# EAGLE design EW Driver (EAGLE 7.5.0)

## Sheet 1 of 2
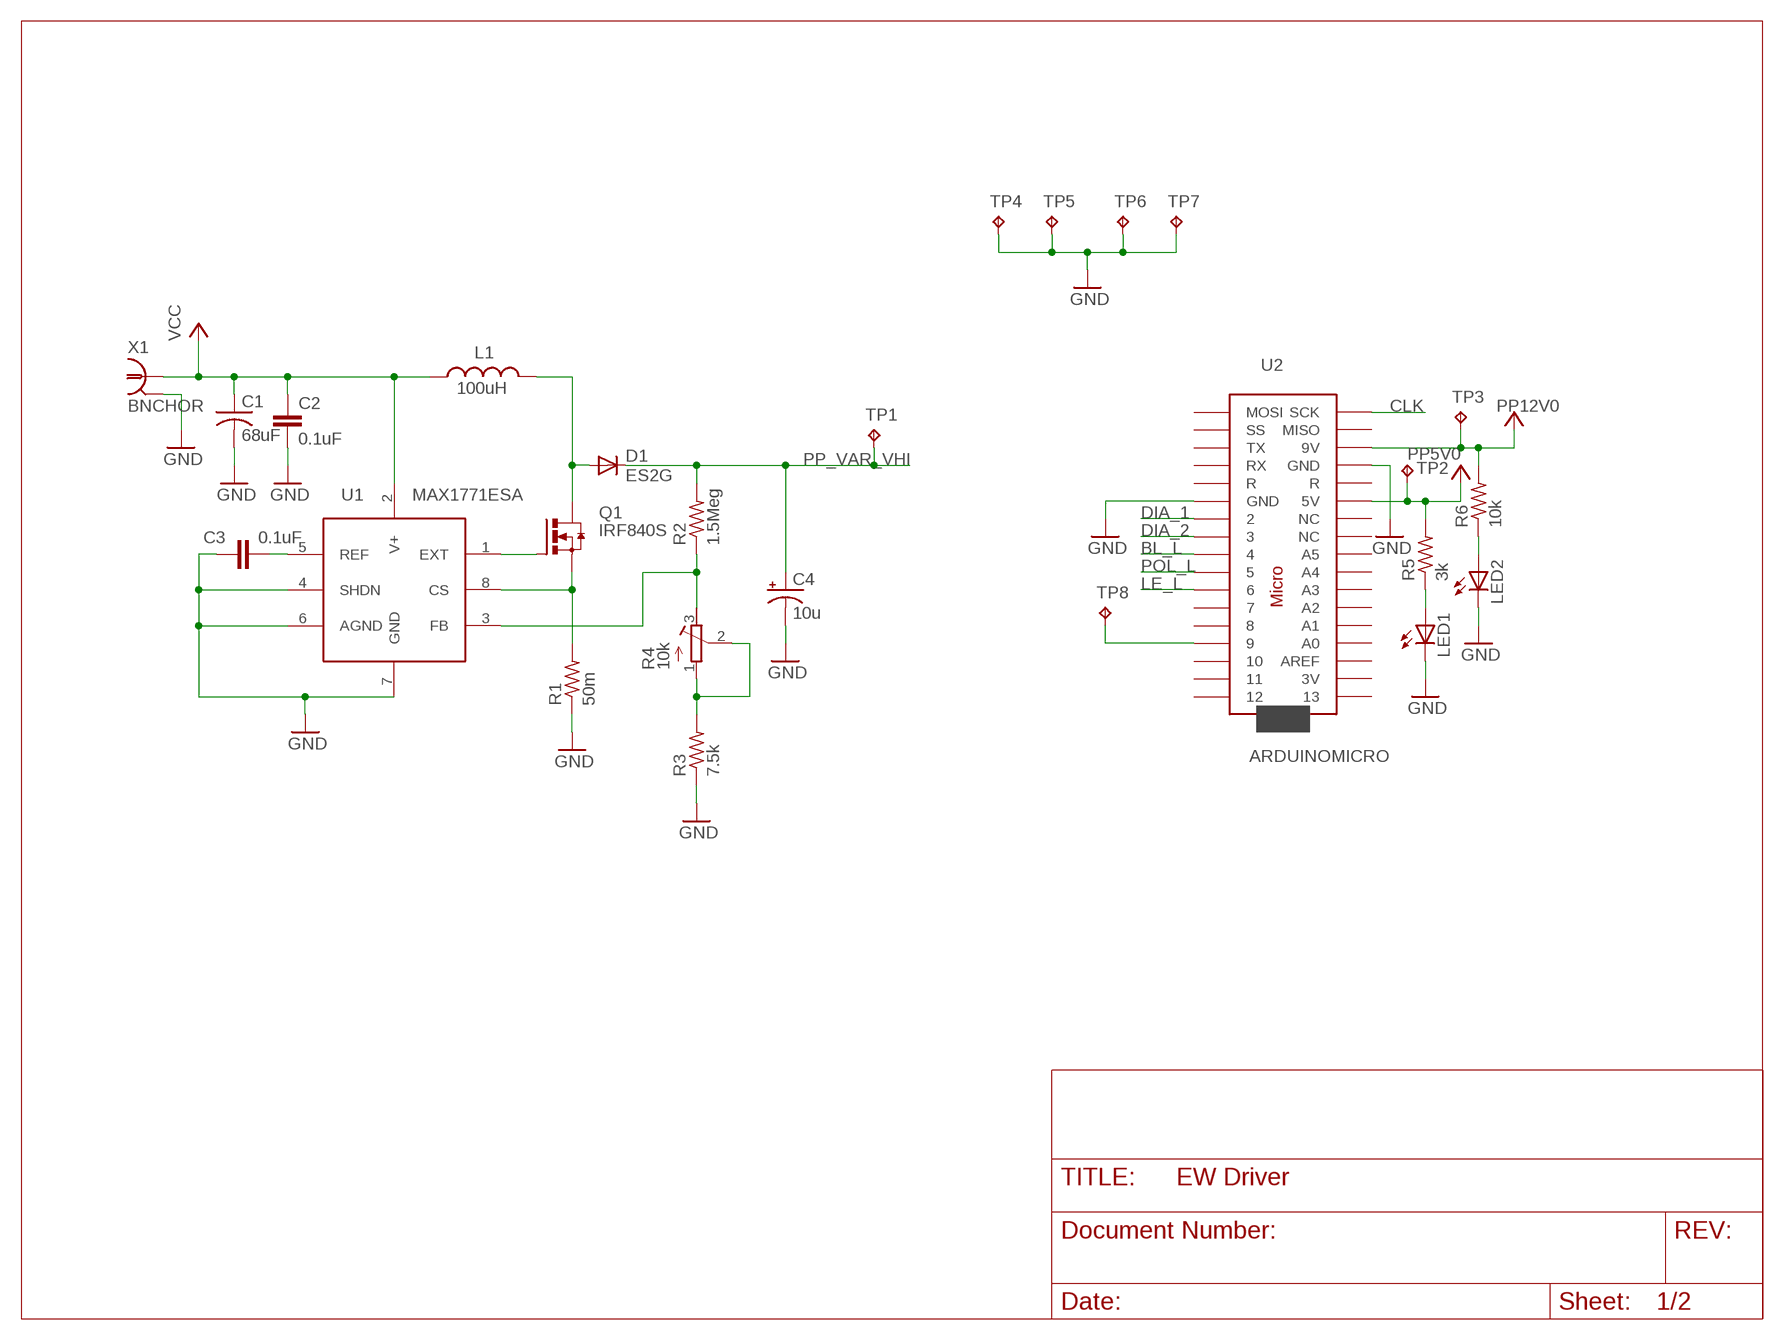
[diagram p0: schematic, sheet 1]

### Parts
C1  68uF  CC2312  [C2312]
C2  0.1uF  CC1206  [C1206]
C3  0.1uF  CC1206  [C1206]
C4  10u  10UF-350V-20%(ELECT)  [PANASONIC_D]
D1  ES2G  DIODE-DO214AA  [DO214AA]
L1  100uH  TDK_IND  [P0762NL]
LED1  LED_ESML0603  [LED_SML0603]
LED2  LED_ESML0603  [LED_SML0603]
Q1  IRF840S  [D2PACK]
R1  50m  R-US_R1206  [R1206]
R2  1.5Meg  R-US_R1206  [R1206]
R3  7.5k  R-US_R0805  [R0805]
R4  10k  R-TRIMM3296P  [RTRIM3296P]
R5  3k  R-US_R0805  [R0805]
R6  10k  R-US_R0805  [R0805]
TP1  TP  [TEST_SMT]
TP2  TP  [TEST_SMT]
TP3  TP  [TEST_SMT]
TP4  TP063  [TEST_TH]
TP5  TP063  [TEST_TH]
TP6  TP063  [TEST_TH]
TP7  TP063  [TEST_TH]
TP8  TP  [TEST_SMT]
U1  MAX1771ESA  [SO08]
U2  ARDUINOMICRO  [ARDUINOMICRO]
X1  BNCHOR  [BNC_HOR]

### Nets
BL_L: U2.P$9 ; also sheet 2
CLK: U2.P$18(SCK) ; also sheet 2
DIA_1: U2.P$11 ; also sheet 2
DIA_2: U2.P$10 ; also sheet 2
GND: C1.2 C2.2 C3.2 C4.- LED1.C LED2.C R1.1 R3.1 TP4.TP TP5.TP TP6.TP TP7.TP U1.4(SHDN) U1.6(AGND) U1.7(GND) U2.P$12(GND) U2.P$21(GND) X1.2 X1.3 ; also sheet 2
LE_L: U2.P$7 ; also sheet 2
N$1: C3.1 U1.5(REF)
N$2: Q1.1(G) U1.1(EXT)
N$3: Q1.3(S) R1.2 U1.8(CS)
N$4: D1.A L1.2 Q1.2(D)
N$5: R3.2 R4.1(A) R4.2(S)
N$6: R2.1 R4.3(E) U1.3(FB)
N$10: LED1.A R5.1
N$11: LED2.A R6.1
N$12: TP8.TP U2.P$4
POL_L: U2.P$8 ; also sheet 2
PP5V0: R5.2 TP2.TP U2.P$23(5V) ; also sheet 2
PP12V0: C1.1 C2.1 L1.1 R6.2 TP3.TP U1.2(V+) U2.P$20(9V) X1.1 ; supply symbol labelled VCC
PP_VAR_VHI: C4.+ D1.C R2.2 TP1.TP ; also sheet 2
Unconnected: U2.P$1 U2.P$2 U2.P$3 U2.P$5 U2.P$6 U2.P$13(R) U2.P$14(RX) U2.P$15(TX) U2.P$16(SS) U2.P$17(MOSI) U2.P$19(MISO) U2.P$22(R) U2.P$24(NC) U2.P$25(NC) U2.P$26(A5) U2.P$27(A4) U2.P$28(A3) U2.P$29(A2) U2.P$30(A1) U2.P$31(A0) U2.P$32(AREF) U2.P$33(3V) U2.P$34

## Sheet 2 of 2
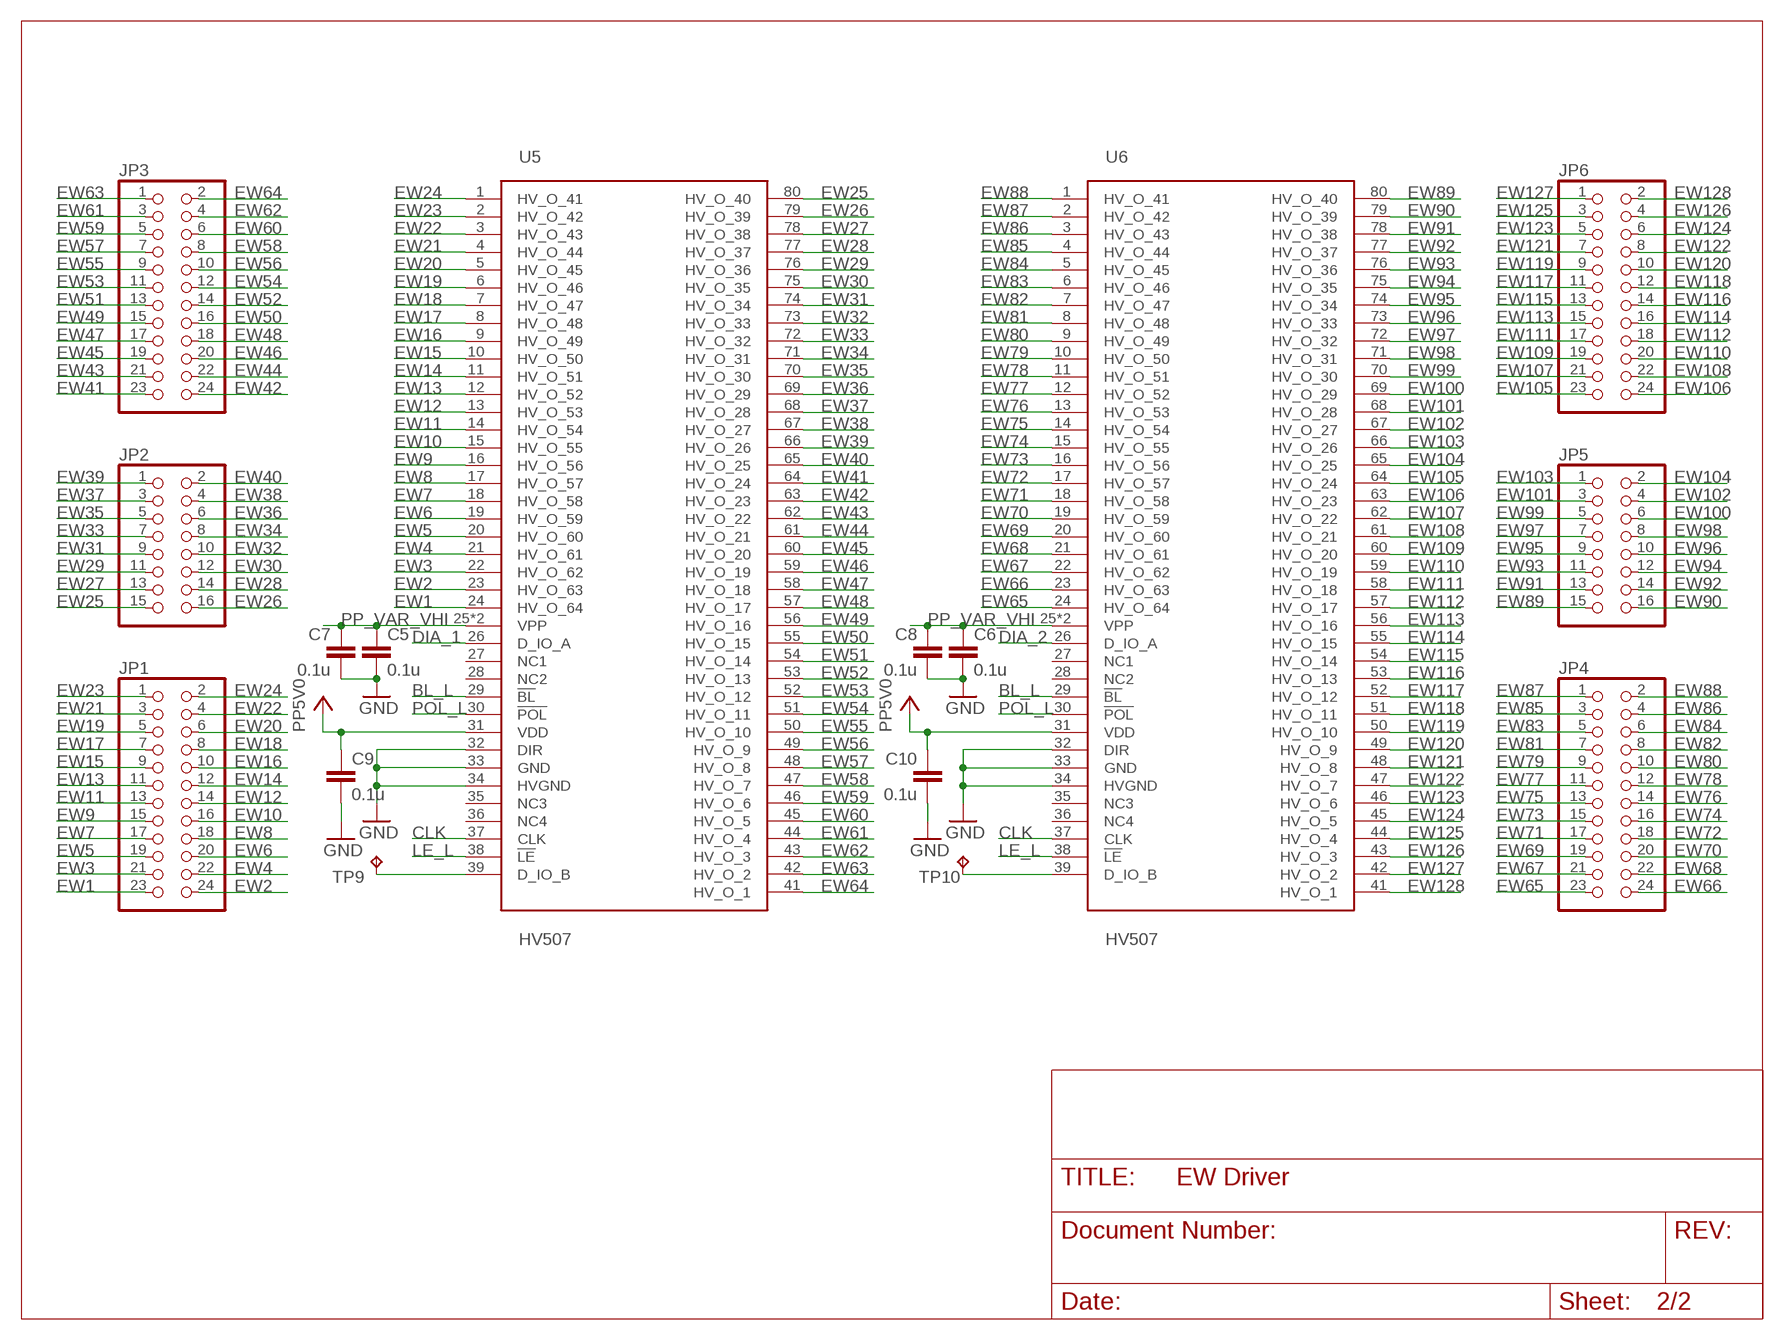
[diagram p1: schematic, sheet 2]

### Parts
C5  0.1u  CC1206  [C1206]
C6  0.1u  CC1206  [C1206]
C7  0.1u  CC1206  [C1206]
C8  0.1u  CC1206  [C1206]
C9  0.1u  CC1206  [C1206]
C10  0.1u  CC1206  [C1206]
JP1  PINHD-2X12_0.05  [2X12_0.05]
JP2  PINHD-2X8_0.05  [2X8_0.05]
JP3  PINHD-2X12_0.05  [2X12_0.05]
JP4  PINHD-2X12_0.05  [2X12_0.05]
JP5  PINHD-2X8_0.05  [2X8_0.05]
JP6  PINHD-2X12_0.05  [2X12_0.05]
TP9  TP  [TEST_SMT]
TP10  TP  [TEST_SMT]
U5  HV507  [HV507PG-G]
U6  HV507  [HV507PG-G]

### Nets
BL_L: U5.29(!BL) U6.29(!BL) ; also sheet 1
CLK: U5.37(CLK) U6.37(CLK) ; also sheet 1
DIA_1: U5.26(D_IO_A) ; also sheet 1
DIA_2: U6.26(D_IO_A) ; also sheet 1
EW1: JP1.23 U5.24(HV_O_64)
EW2: JP1.24 U5.23(HV_O_63)
EW3: JP1.21 U5.22(HV_O_62)
EW4: JP1.22 U5.21(HV_O_61)
EW5: JP1.19 U5.20(HV_O_60)
EW6: JP1.20 U5.19(HV_O_59)
EW7: JP1.17 U5.18(HV_O_58)
EW8: JP1.18 U5.17(HV_O_57)
EW9: JP1.15 U5.16(HV_O_56)
EW10: JP1.16 U5.15(HV_O_55)
EW11: JP1.13 U5.14(HV_O_54)
EW12: JP1.14 U5.13(HV_O_53)
EW13: JP1.11 U5.12(HV_O_52)
EW14: JP1.12 U5.11(HV_O_51)
EW15: JP1.9 U5.10(HV_O_50)
EW16: JP1.10 U5.9(HV_O_49)
EW17: JP1.7 U5.8(HV_O_48)
EW18: JP1.8 U5.7(HV_O_47)
EW19: JP1.5 U5.6(HV_O_46)
EW20: JP1.6 U5.5(HV_O_45)
EW21: JP1.3 U5.4(HV_O_44)
EW22: JP1.4 U5.3(HV_O_43)
EW23: JP1.1 U5.2(HV_O_42)
EW24: JP1.2 U5.1(HV_O_41)
EW25: JP2.15 U5.80(HV_O_40)
EW26: JP2.16 U5.79(HV_O_39)
EW27: JP2.13 U5.78(HV_O_38)
EW28: JP2.14 U5.77(HV_O_37)
EW29: JP2.11 U5.76(HV_O_36)
EW30: JP2.12 U5.75(HV_O_35)
EW31: JP2.9 U5.74(HV_O_34)
EW32: JP2.10 U5.73(HV_O_33)
EW33: JP2.7 U5.72(HV_O_32)
EW34: JP2.8 U5.71(HV_O_31)
EW35: JP2.5 U5.70(HV_O_30)
EW36: JP2.6 U5.69(HV_O_29)
EW37: JP2.3 U5.68(HV_O_28)
EW38: JP2.4 U5.67(HV_O_27)
EW39: JP2.1 U5.66(HV_O_26)
EW40: JP2.2 U5.65(HV_O_25)
EW41: JP3.23 U5.64(HV_O_24)
EW42: JP3.24 U5.63(HV_O_23)
EW43: JP3.21 U5.62(HV_O_22)
EW44: JP3.22 U5.61(HV_O_21)
EW45: JP3.19 U5.60(HV_O_20)
EW46: JP3.20 U5.59(HV_O_19)
EW47: JP3.17 U5.58(HV_O_18)
EW48: JP3.18 U5.57(HV_O_17)
EW49: JP3.15 U5.56(HV_O_16)
EW50: JP3.16 U5.55(HV_O_15)
EW51: JP3.13 U5.54(HV_O_14)
EW52: JP3.14 U5.53(HV_O_13)
EW53: JP3.11 U5.52(HV_O_12)
EW54: JP3.12 U5.51(HV_O_11)
EW55: JP3.9 U5.50(HV_O_10)
EW56: JP3.10 U5.49(HV_O_9)
EW57: JP3.7 U5.48(HV_O_8)
EW58: JP3.8 U5.47(HV_O_7)
EW59: JP3.5 U5.46(HV_O_6)
EW60: JP3.6 U5.45(HV_O_5)
EW61: JP3.3 U5.44(HV_O_4)
EW62: JP3.4 U5.43(HV_O_3)
EW63: JP3.1 U5.42(HV_O_2)
EW64: JP3.2 U5.41(HV_O_1)
EW65: JP4.23 U6.24(HV_O_64)
EW66: JP4.24 U6.23(HV_O_63)
EW67: JP4.21 U6.22(HV_O_62)
EW68: JP4.22 U6.21(HV_O_61)
EW69: JP4.19 U6.20(HV_O_60)
EW70: JP4.20 U6.19(HV_O_59)
EW71: JP4.17 U6.18(HV_O_58)
EW72: JP4.18 U6.17(HV_O_57)
EW73: JP4.15 U6.16(HV_O_56)
EW74: JP4.16 U6.15(HV_O_55)
EW75: JP4.13 U6.14(HV_O_54)
EW76: JP4.14 U6.13(HV_O_53)
EW77: JP4.11 U6.12(HV_O_52)
EW78: JP4.12 U6.11(HV_O_51)
EW79: JP4.9 U6.10(HV_O_50)
EW80: JP4.10 U6.9(HV_O_49)
EW81: JP4.7 U6.8(HV_O_48)
EW82: JP4.8 U6.7(HV_O_47)
EW83: JP4.5 U6.6(HV_O_46)
EW84: JP4.6 U6.5(HV_O_45)
EW85: JP4.3 U6.4(HV_O_44)
EW86: JP4.4 U6.3(HV_O_43)
EW87: JP4.1 U6.2(HV_O_42)
EW88: JP4.2 U6.1(HV_O_41)
EW89: JP5.15 U6.80(HV_O_40)
EW90: JP5.16 U6.79(HV_O_39)
EW91: JP5.13 U6.78(HV_O_38)
EW92: JP5.14 U6.77(HV_O_37)
EW93: JP5.11 U6.76(HV_O_36)
EW94: JP5.12 U6.75(HV_O_35)
EW95: JP5.9 U6.74(HV_O_34)
EW96: JP5.10 U6.73(HV_O_33)
EW97: JP5.7 U6.72(HV_O_32)
EW98: JP5.8 U6.71(HV_O_31)
EW99: JP5.5 U6.70(HV_O_30)
EW100: JP5.6 U6.69(HV_O_29)
EW101: JP5.3 U6.68(HV_O_28)
EW102: JP5.4 U6.67(HV_O_27)
EW103: JP5.1 U6.66(HV_O_26)
EW104: JP5.2 U6.65(HV_O_25)
EW105: JP6.23 U6.64(HV_O_24)
EW106: JP6.24 U6.63(HV_O_23)
EW107: JP6.21 U6.62(HV_O_22)
EW108: JP6.22 U6.61(HV_O_21)
EW109: JP6.19 U6.60(HV_O_20)
EW110: JP6.20 U6.59(HV_O_19)
EW111: JP6.17 U6.58(HV_O_18)
EW112: JP6.18 U6.57(HV_O_17)
EW113: JP6.15 U6.56(HV_O_16)
EW114: JP6.16 U6.55(HV_O_15)
EW115: JP6.13 U6.54(HV_O_14)
EW116: JP6.14 U6.53(HV_O_13)
EW117: JP6.11 U6.52(HV_O_12)
EW118: JP6.12 U6.51(HV_O_11)
EW119: JP6.9 U6.50(HV_O_10)
EW120: JP6.10 U6.49(HV_O_9)
EW121: JP6.7 U6.48(HV_O_8)
EW122: JP6.8 U6.47(HV_O_7)
EW123: JP6.5 U6.46(HV_O_6)
EW124: JP6.6 U6.45(HV_O_5)
EW125: JP6.3 U6.44(HV_O_4)
EW126: JP6.4 U6.43(HV_O_3)
EW127: JP6.1 U6.42(HV_O_2)
EW128: JP6.2 U6.41(HV_O_1)
GND: C5.2 C6.2 C7.2 C8.2 C9.2 C10.2 U5.32(DIR) U5.33(GND) U5.34(HVGND) U6.32(DIR) U6.33(GND) U6.34(HVGND) ; also sheet 1
LE_L: U5.38(!LE) U6.38(!LE) ; also sheet 1
N$13: TP9.TP U5.39(D_IO_B)
N$14: TP10.TP U6.39(D_IO_B)
POL_L: U5.30(!POL) U6.30(!POL) ; also sheet 1
PP5V0: C9.1 C10.1 U5.31(VDD) U6.31(VDD) ; also sheet 1
PP_VAR_VHI: C5.1 C6.1 C7.1 C8.1 U5.25(VPP) U5.40(VPP) U6.25(VPP) U6.40(VPP) ; also sheet 1
Unconnected: U5.27(NC1) U5.28(NC2) U5.35(NC3) U5.36(NC4) U6.27(NC1) U6.28(NC2) U6.35(NC3) U6.36(NC4)

## Library data of the parts
C1 = mimi:CC2312
C2 C3 C5-C10 = eagle-ltspice:C: CAPACITOR, European symbol; SPICEMODEL: NONE; SPICEPREFIX: C
C4 = mimi:10UF-350V-20%(ELECT): Panasonic EB; PROD_ID: CAP-10547
D1 = diode:DIODE-: DIODE
JP1 JP3 JP4 JP6 = mimi:PINHD-2X12_0.05: PIN HEADER
JP2 JP5 = mimi:PINHD-2X8_0.05
L1 = mimi:TDK_IND
LED1 LED2 = mimi:LED_E: LED Source: http://www.osram.convergy.de Source: www.luxeon.com Source: www.kingbright.com; SPICEMODEL: NONE; SPICEPREFIX: D; SPICETYPE: diode
Q1 = mimi:IRF840: SMPS MOSFET HEXFET® Power MOSFET Source: http://www.irf.com/product-info/datasheets/data/irf3704.pdf
R1 R2 R5 R6 = resistor:R-US_: RESISTOR, American symbol
R3 = rcl:R-US_: RESISTOR, American symbol
R4 = rcl:R-TRIMM: Trimm resistor
TP1-TP10 = mimi:TP
U1 = mimi:MAX1771
U2 = mimi:ARDUINOMICRO
U5 U6 = mimi:HV507
X1 = mimi:BNC: BNC CONNECTOR M/A COM www.macom.com distributor Farnell 149-452

## Board
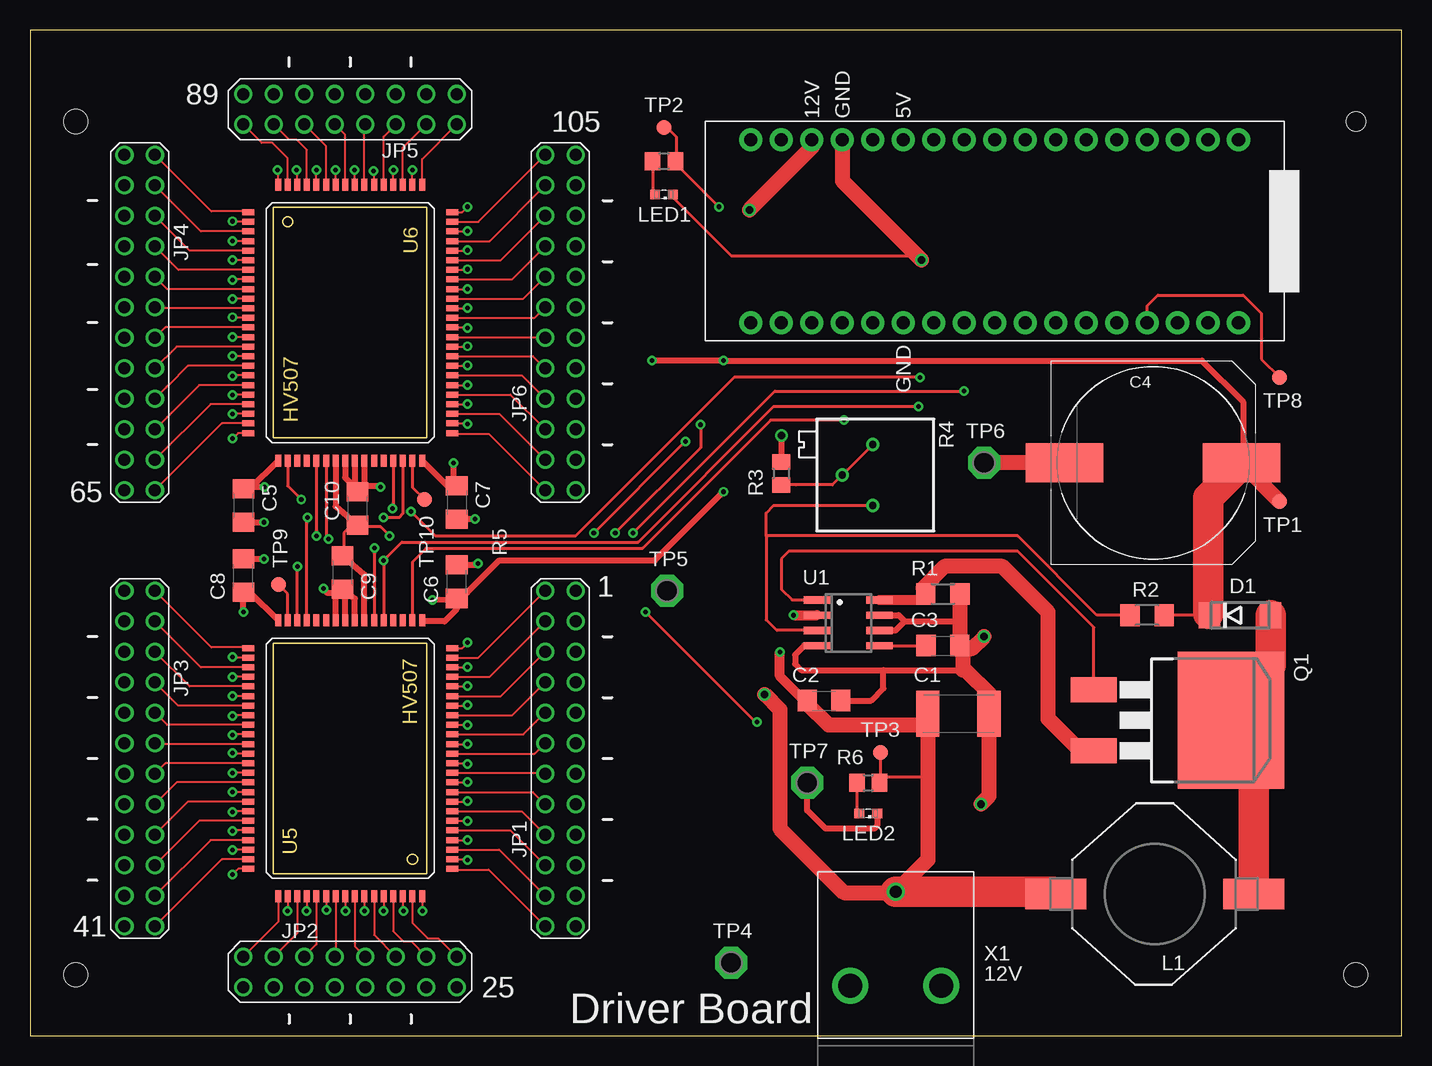
[diagram p2: board, top side]
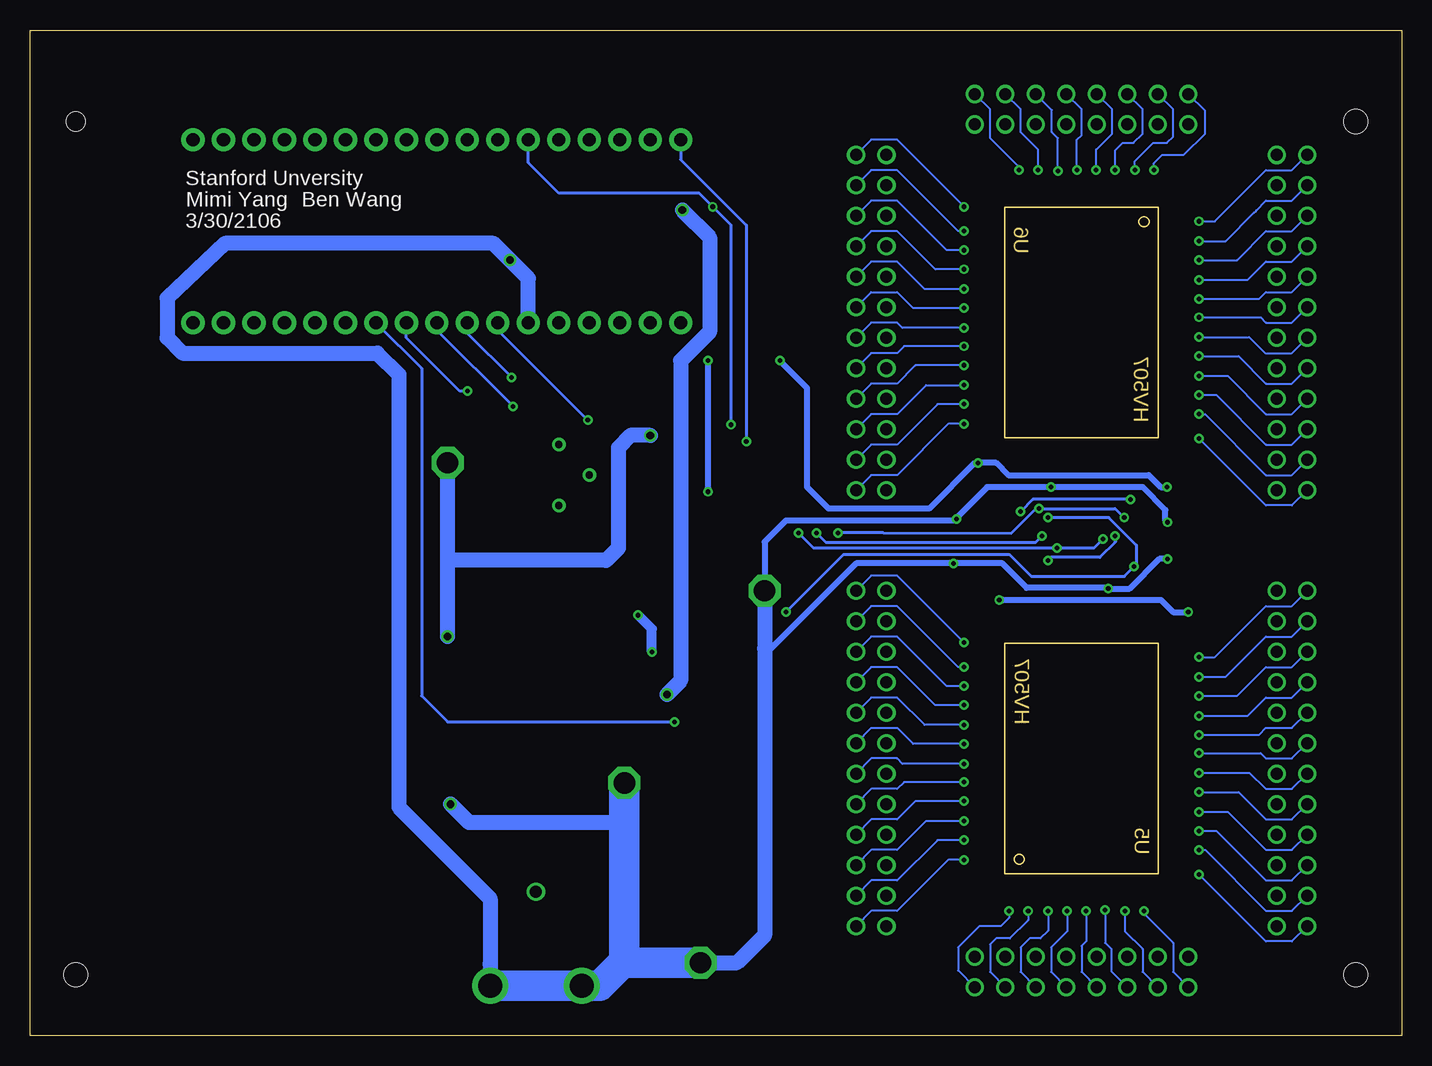
[diagram p3: board, bottom side, seen from below]

Size 114.3 x 83.82 mm. Coordinates in mm from the lower left corner, seen from the top.
Outline: 0,0 114.3,0 114.3,83.82 0,83.82 0,0
Copper layers (1*16): Top 0.035559375mm / dielectric 1.501140625mm / Bottom 0.035559375mm
Design rules "typical_4pcb *": minimum track width 6mil, minimum drill 15mil, track to track 6mil, track to pad 6mil, pad to pad 6mil, via to via 6mil, smd to smd 6mil, copper to edge 15mil, drill to drill 8mil, minimum pad ring 10mil, minimum via ring 8mil, stop-mask expansion 4mil, vias tented up to drill 15mil, thermal gap 10mil
Holes 2 mm at 3.81,5.08 3.81,76.2 110.49,5.08
Holes 1.6 mm at 110.49,76.2

### Footprints (pad centres in the part's own frame; a part is rotated, then mirrored left to right if it is on the bottom)
C2312 = smd 1.93 x 3.81: 1 -0.75,-0.9; 2 4.35,-0.9
C1206 = smd 1.6 x 1.8: 1 -1.4,0; 2 1.4,0
PANASONIC_D = smd 6.452 x 3.251: + 7.35,0; - -7.4,0
DO214AA = smd 1.8 x 2.2: A 2.55,0; C -2.55,0
2X12_0.05 = drill 1 pad 1.372: 1 -13.97,-1.27; 2 -13.97,1.27; 3 -11.43,-1.27; 4 -11.43,1.27; 5 -8.89,-1.27; 6 -8.89,1.27; 7 -6.35,-1.27; 8 -6.35,1.27; 9 -3.81,-1.27; 10 -3.81,1.27; 11 -1.27,-1.27; 12 -1.27,1.27; 13 1.27,-1.27; 14 1.27,1.27; 15 3.81,-1.27; 16 3.81,1.27; 17 6.35,-1.27; 18 6.35,1.27; 19 8.89,-1.27; 20 8.89,1.27; 21 11.43,-1.27; 22 11.43,1.27; 23 13.97,-1.27; 24 13.97,1.27
2X8_0.05 = drill 1 pad 1.372: 1 -8.89,-1.27; 2 -8.89,1.27; 3 -6.35,-1.27; 4 -6.35,1.27; 5 -3.81,-1.27; 6 -3.81,1.27; 7 -1.27,-1.27; 8 -1.27,1.27; 9 1.27,-1.27; 10 1.27,1.27; 11 3.81,-1.27; 12 3.81,1.27; 13 6.35,-1.27; 14 6.35,1.27; 15 8.89,-1.27; 16 8.89,1.27
P0762NL = smd 2.54 x 5.08: 1 0,8.256; 2 0,-8.256
LED_SML0603 = smd 0.8 x 0.8: A 0.75,0; C -0.75,0
D2PACK = smd 2.083 x 3.81: 1 -2.54,-8.89; 3 2.54,-8.89 | smd 11.43 x 8.89: 2 0,2.54
R1206 = smd 1.6 x 1.803: 1 -1.422,0; 2 1.422,0
R0805 = smd 1.3 x 1.5: 1 -0.95,0; 2 0.95,0
RTRIM3296P = drill 0.61: 1 0,-2.54; 2 2.54,0; 3 0,2.54
TEST_SMT = smd 1.27 x 1.27: TP 0,0
TEST_TH = drill 1.778 octagon: TP 0,0
SO08 = smd 0.6 x 2.2: 1 -1.905,-2.6; 2 -0.635,-2.6; 3 0.635,-2.6; 4 1.905,-2.6; 5 1.905,2.6; 6 0.635,2.6; 7 -0.635,2.6; 8 -1.905,2.6
ARDUINOMICRO = drill 1.1 pad 1.93: P$1 -20.32,7.62; P$2 -17.78,7.62; P$3 -15.24,7.62; P$4 -12.7,7.62; P$5 -10.16,7.62; P$6 -7.62,7.62; P$7 -5.08,7.62; P$8 -2.54,7.62; P$9 0,7.62; P$10 2.54,7.62; P$11 5.08,7.62; P$12 12.7,-7.62; P$13 10.16,-7.62; P$14 12.7,7.62; P$15 15.24,7.62; P$16 17.78,7.62; P$17 20.32,7.62; P$18 20.32,-7.62; P$19 17.78,-7.62; P$20 15.24,-7.62; P$21 7.62,7.62; P$22 10.16,7.62; P$23 7.62,-7.62; P$24 5.08,-7.62; P$25 2.54,-7.62; P$26 0,-7.62; P$27 -2.54,-7.62; P$28 -5.08,-7.62; P$29 -7.62,-7.62; P$30 -10.16,-7.62; P$31 -12.7,-7.62; P$32 -15.24,-7.62; P$33 -17.78,-7.62; P$34 -20.32,-7.62
HV507PG-G = smd 0.5 x 1: 1 -9.2,-8.5; 2 -8.4,-8.5; 3 -7.6,-8.5; 4 -6.8,-8.5; 5 -6,-8.5; 6 -5.2,-8.5; 7 -4.4,-8.5; 8 -3.6,-8.5; 9 -2.8,-8.5; 10 -2,-8.5; 11 -1.2,-8.5; 12 -0.4,-8.5; 13 0.4,-8.5; 14 1.2,-8.5; 15 2,-8.5; 16 2.8,-8.5; 17 3.6,-8.5; 18 4.4,-8.5; 19 5.2,-8.5; 20 6,-8.5; 21 6.8,-8.5; 22 7.6,-8.5; 23 8.4,-8.5; 24 9.2,-8.5; 41 9.2,8.5; 42 8.4,8.5; 43 7.6,8.5; 44 6.8,8.5; 45 6,8.5; 46 5.2,8.5; 47 4.4,8.5; 48 3.6,8.5; 49 2.8,8.5; 50 2,8.5; 51 1.2,8.5; 52 0.4,8.5; 53 -0.4,8.5; 54 -1.2,8.5; 55 -2,8.5; 56 -2.8,8.5; 57 -3.6,8.5; 58 -4.4,8.5; 59 -5.2,8.5; 60 -6,8.5; 61 -6.8,8.5; 62 -7.6,8.5; 63 -8.4,8.5; 64 -9.2,8.5 | smd 1 x 0.5: 25 11.5,-6; 26 11.5,-5.2; 27 11.5,-4.4; 28 11.5,-3.6; 29 11.5,-2.8; 30 11.5,-2; 31 11.5,-1.2; 32 11.5,-0.4; 33 11.5,0.4; 34 11.5,1.2; 35 11.5,2; 36 11.5,2.8; 37 11.5,3.6; 38 11.5,4.4; 39 11.5,5.2; 40 11.5,6; 65 -11.5,6; 66 -11.5,5.2; 67 -11.5,4.4; 68 -11.5,3.6; 69 -11.5,2.8; 70 -11.5,2; 71 -11.5,1.2; 72 -11.5,0.4; 73 -11.5,-0.4; 74 -11.5,-1.2; 75 -11.5,-2; 76 -11.5,-2.8; 77 -11.5,-3.6; 78 -11.5,-4.4; 79 -11.5,-5.2; 80 -11.5,-6
BNC_HOR = drill 1: 1 0,7.8 | drill 2: 2 3.8,0; 3 -3.8,0

### Placement (x,y rotation side)
C1  75.56,27.75 0 top
C2  66.17,27.94 0 top
C3  76.07,32.51 0 top
C4  93.6,47.75 0 top
C5  17.78,44.2 270 top
C6  35.56,37.85 90 top
C7  35.56,44.45 270 top
C8  17.78,38.35 90 top
C9  26.03,38.61 270 top
C10  27.3,43.94 90 top
D1  100.84,35.05 0 top
JP1  44.2,23.11 90 top
JP2  26.67,5.33 0 top
JP3  9.14,23.11 270 top
JP4  9.14,59.44 270 top
JP5  26.67,77.22 180 top
JP6  44.2,59.44 90 top
L1  93.73,11.81 90 top
LED1  52.83,70.1 180 top
LED2  69.85,18.54 180 top
Q1  97.54,26.29 270 top
R1  76.07,36.83 180 top
R2  93.09,35.05 0 top
R3  62.61,46.86 270 top
R4  70.23,46.74 180 top
R5  52.83,72.9 0 top
R6  69.85,21.08 0 top
TP1  104.14,44.51 0 top
TP2  52.83,75.69 0 top
TP3  70.87,23.62 0 top
TP4  58.42,6.1 0 top
TP5  53.09,37.08 0 top
TP6  79.5,47.75 0 top
TP7  64.77,21.08 0 top
TP8  104.14,54.86 0 top
TP9  20.7,37.59 90 top
TP10  32.89,44.7 270 top
U1  68.2,34.42 270 top
U2  80.39,67.06 180 top
U5  26.67,23.11 90 top
U6  26.67,59.44 270 top
X1  72.14,4.19 0 top

### Tracks (layer width: path | path; a pad name or v marks a point on that pad's centre or on a via)
BL_L  (via drill 0.38, 0.38 pad 0.64)
  Top 0.254: v74.04,52.45 61.98,52.45 50.67,41.15 30.99,41.15 v29.46,39.62 U5.29 | U6.29 v23.87,41.66 v23.88,41.66
  Bottom 0.254: U2.P$9 80.39,58.8 v74.04,52.45 | v29.46,39.62 29.21,39.88 25.15,39.88 23.88,41.15 v23.88,41.66
CLK  (via drill 0.38)
  Top 0.254: 23.11,34.57 U5.37 23.07,43.14 v23.11,43.18 | v30.23,43.94 30.27,43.99 U6.37 | v46.98,41.9 v54.61,49.53
  Bottom 0.254: v23.11,43.18 23.88,43.94 v30.23,43.94 30.48,43.94 32.52,41.9 43.18,41.91 v46.97,41.91 v46.98,41.9 | U2.P$18 60.07,73.03 54.61,67.56 v54.61,49.53
DIA_1  (via drill 0.38)
  Top 0.254: v67.82,51.31 61.72,51.31 51.05,40.64 33.02,40.64 31.88,39.5 31.88,34.62 U5.26
  Bottom 0.254: U2.P$11 75.31,58.8 v67.82,51.31
DIA_2  (via drill 0.38)
  Top 0.254: v74.17,54.86 58.67,54.86 45.47,41.66 33.78,41.66 v31.75,43.69 | U6.26 21.47,45.84 v22.61,44.7
  Bottom 0.254: U2.P$10 77.85,58.55 v74.17,54.86 | v22.61,44.7 30.73,44.7 v31.75,43.69
EW1  (via drill 0.38)
  Top 0.152: U5.24 36.01,32.31 v36.45,32.77
  Bottom 0.152: JP1.23 44.2,38.35 42.04,38.35 v36.45,32.77
EW2
  Top 0.152: U5.23 37.36,31.51 JP1.24
EW3  (via drill 0.38)
  Top 0.152: U5.22 36.43,30.71 v36.45,30.73
  Bottom 0.152: JP1.21 44.2,35.81 42.04,35.81 36.96,30.73 v36.45,30.73
EW4
  Top 0.152: U5.21 38.3,29.91 JP1.22
EW5  (via drill 0.38)
  Top 0.152: U5.20 36.48,29.11 v36.45,29.15
  Bottom 0.152: JP1.19 44.2,33.27 42.04,33.27 37.91,29.15 v36.45,29.15
EW6
  Top 0.152: U5.19 39.24,28.31 JP1.20
EW7  (via drill 0.38)
  Top 0.152: U5.18 36.4,27.51 v36.45,27.56
  Bottom 0.152: JP1.17 44.2,30.73 42.04,30.73 38.86,27.56 v36.45,27.56
EW8
  Top 0.152: U5.17 40.18,26.71 JP1.18
EW9  (via drill 0.38)
  Top 0.152: U5.16 36.19,25.91 v36.45,25.91
  Top 0.254: U5.16
  Bottom 0.152: JP1.15 44.2,28.19 42.04,28.19 39.75,25.91 v36.45,25.91
EW10
  Top 0.152: JP1.16 42.16,26.16 41.78,25.78 41.12,25.11 U5.15
EW11  (via drill 0.38)
  Top 0.152: U5.14 36.38,24.31 v36.45,24.32
  Bottom 0.152: JP1.13 44.2,25.65 42.04,25.65 40.7,24.32 v36.45,24.32
EW12
  Top 0.152: U5.13 42.06,23.51 JP1.14
EW13  (via drill 0.38)
  Top 0.152: U5.12 36.72,22.71 v36.45,22.67
  Bottom 0.152: v36.45,22.67 41.59,22.67 42.04,23.11 44.2,23.11 JP1.11
EW14
  Top 0.152: U5.11 42.86,21.91 JP1.12
EW15  (via drill 0.38)
  Top 0.152: 35.17,21.14 U5.10 36.48,21.11 v36.45,21.14
  Bottom 0.152: v36.45,21.14 41.47,21.14 42.04,20.57 44.2,20.57 JP1.9
EW16
  Top 0.152: U5.9 41.92,20.31 JP1.10
EW17  (via drill 0.38)
  Top 0.152: 35.17,19.56 U5.8 36.41,19.51 v36.45,19.56
  Bottom 0.152: v36.45,19.56 40.51,19.56 42.04,18.03 44.2,18.03 JP1.7
EW18
  Top 0.152: U5.7 40.98,18.71 JP1.8
EW19  (via drill 0.38)
  Top 0.152: U5.6 v36.46,17.91 | 36.51,17.91 v36.46,17.91 | v36.46,17.91 v36.45,17.91
  Bottom 0.152: JP1.5 44.2,15.49 42.04,15.49 39.62,17.91 v36.46,17.91 v36.45,17.91
EW20
  Top 0.152: U5.5 40.04,17.11 JP1.6
EW21  (via drill 0.38)
  Top 0.152: U5.4 v36.44,16.31 v36.45,16.32
  Bottom 0.152: JP1.3 44.2,12.95 42.04,12.95 38.67,16.32 v36.45,16.32
EW22
  Top 0.152: U5.3 39.1,15.51 JP1.4
EW23  (via drill 0.38)
  Top 0.152: U5.2 36.34,14.71 v36.45,14.67
  Bottom 0.152: JP1.1 44.2,10.41 42.04,10.41 37.78,14.67 v36.45,14.67
EW24
  Top 0.152: 35.17,13.85 U5.1 35.17,13.85 | 35.17,13.85 38.22,13.85 JP1.2
EW25  (via drill 0.38)
  Top 0.152: U5.80 32.67,10.51 v32.7,10.41
  Bottom 0.152: v32.7,10.41 32.7,9.84 33.4,9.14 35.18,9.14 36.96,7.37 36.96,5.46 JP2.15
EW26
  Top 0.152: U5.79 31.87,9.4 33.15,8.13 34.04,8.13 JP2.16
EW27  (via drill 0.38)
  Top 0.152: U5.78 31.07,10.46 v31.12,10.41
  Bottom 0.152: v31.12,10.41 31.12,9.65 32.64,8.13 33.78,8.13 34.29,7.62 34.29,5.33 JP2.13
EW28
  Top 0.152: U5.77 30.27,8.72 31.12,7.87 31.75,7.87 JP2.14
EW29  (via drill 0.38)
  Top 0.152: U5.76 29.47,10.48 v29.46,10.41
  Bottom 0.152: v29.46,10.41 29.46,8.76 30.1,8.13 30.99,8.13 31.75,7.37 31.75,5.33 JP2.11
EW30
  Top 0.152: U5.75 28.67,8.41 JP2.12
EW31  (via drill 0.38)
  Top 0.152: U5.74 27.87,10.48 v27.88,10.41
  Bottom 0.152: v27.88,10.41 27.88,8.7 29.21,7.37 29.21,5.33 JP2.9
EW32
  Top 0.152: U5.73 27.07,7.47 JP2.10
EW33  (via drill 0.38)
  Top 0.152: U5.72 26.27,10.43 v26.29,10.41
  Bottom 0.152: v26.29,10.41 26.29,7.87 26.67,7.49 26.67,5.33 JP2.7
EW34
  Top 0.152: U5.71 25.47,6.67 JP2.8
EW35  (via drill 0.38)
  Top 0.152: U5.70 24.67,10.51 v24.7,10.48
  Bottom 0.152: v24.7,10.48 24.7,7.75 24.19,7.24 24.19,5.4 JP2.5
EW36
  Top 0.152: U5.69 23.87,7.61 JP2.6
EW37  (via drill 0.38)
  Top 0.152: U5.68 23.07,10.5 v23.05,10.41
  Bottom 0.152: v23.05,10.41 23.05,8.7 21.59,7.24 21.59,5.33 JP2.3
EW38
  Top 0.152: U5.67 22.27,8.55 JP2.4
EW39  (via drill 0.38)
  Top 0.152: U5.66 21.47,10.48 v21.46,10.41
  Bottom 0.152: v21.46,10.41 21.46,10.16 19.05,7.75 19.05,5.33 JP2.1
EW40
  Top 0.152: U5.65 20.67,9.49 JP2.2
EW41  (via drill 0.38)
  Top 0.152: U5.64 17.34,13.91 v16.89,13.46
  Bottom 0.152: JP3.23 9.14,7.87 11.3,7.87 v16.89,13.46
EW42
  Top 0.152: U5.63 15.98,14.71 JP3.24
EW43  (via drill 0.38)
  Top 0.152: U5.62 16.91,15.51 v16.89,15.49
  Bottom 0.152: JP3.21 9.14,10.41 11.3,10.41 16.38,15.49 v16.89,15.49
EW44
  Top 0.152: U5.61 15.04,16.31 JP3.22
EW45  (via drill 0.38)
  Top 0.152: 16.86,17.11 v16.89,17.08 16.92,17.11 U5.60
  Bottom 0.152: JP3.19 9.14,12.95 11.3,12.95 15.43,17.08 v16.89,17.08
EW46
  Top 0.152: JP3.20 11.43,15.24 11.81,15.62 14.1,17.91 U5.59
EW47  (via drill 0.38)
  Top 0.152: U5.58 16.94,18.71 v16.89,18.67
  Bottom 0.152: JP3.17 9.14,15.49 11.3,15.49 14.48,18.67 v16.89,18.67
EW48
  Top 0.152: JP3.18 11.37,17.72 11.56,17.91 13.16,19.51 U5.57
EW49  (via drill 0.38)
  Top 0.152: 17.15,20.31 v16.89,20.32 v16.9,20.31 U5.56
  Bottom 0.152: JP3.15 9.14,18.03 11.3,18.03 13.59,20.32 v16.89,20.32
EW50
  Top 0.152: JP3.16 12.22,21.11 U5.55
EW51  (via drill 0.38)
  Top 0.152: 16.96,21.91 v16.89,21.91 v16.9,21.91 U5.54
  Bottom 0.152: v16.89,21.91 12.7,21.91 11.3,20.57 9.14,20.57 JP3.13
EW52
  Top 0.152: JP3.14 11.28,22.71 U5.53
EW53  (via drill 0.38)
  Top 0.152: 16.62,23.51 v16.89,23.56 16.94,23.51 U5.52
  Bottom 0.152: v16.89,23.56 11.75,23.56 11.3,23.11 9.14,23.11 JP3.11
EW54
  Top 0.152: U5.51 10.48,24.31 JP3.12
EW55  (via drill 0.38)
  Top 0.152: 16.86,25.11 v16.89,25.08 16.92,25.11 U5.50
  Bottom 0.152: v16.89,25.08 11.87,25.08 11.3,25.65 9.14,25.65 JP3.9
EW56
  Top 0.152: JP3.10 11.42,25.91 U5.49
EW57  (via drill 0.38)
  Top 0.152: U5.48 16.94,26.71 v16.89,26.67
  Bottom 0.152: v16.89,26.67 12.83,26.67 11.3,28.19 9.14,28.19 JP3.7
EW58
  Top 0.152: JP3.8 12.36,27.51 U5.47
EW59  (via drill 0.38)
  Top 0.152: 16.84,28.31 v16.89,28.32 v16.9,28.31 U5.46
  Bottom 0.152: JP3.5 9.14,30.73 11.3,30.73 13.72,28.32 v16.89,28.32
EW60
  Top 0.152: U5.45 13.3,29.11 JP3.6
EW61  (via drill 0.38)
  Top 0.152: U5.44 v16.9,29.91 v16.89,29.91
  Bottom 0.152: JP3.3 9.14,33.27 11.3,33.27 12.13,32.45 12.32,32.26 14.67,29.91 v16.89,29.91
EW62
  Top 0.152: U5.43 14.24,30.71 JP3.4
EW63  (via drill 0.38)
  Top 0.152: 17,31.51 v16.89,31.56 16.94,31.51 U5.42
  Bottom 0.152: JP3.1 9.14,35.81 11.3,35.81 15.56,31.56 v16.89,31.56
EW64
  Top 0.152: U5.41 18.17,32.38 15.12,32.38 JP3.2
EW65  (via drill 0.38)
  Top 0.152: U6.24 17.34,50.24 v16.89,49.78
  Bottom 0.152: JP4.23 9.14,44.2 11.3,44.2 v16.89,49.78
EW66
  Top 0.152: U6.23 15.98,51.04 JP4.24
EW67  (via drill 0.38)
  Top 0.152: U6.22 16.91,51.84 v16.89,51.82
  Bottom 0.152: JP4.21 9.14,46.74 11.3,46.74 16.38,51.82 v16.89,51.82
EW68
  Top 0.152: U6.21 15.04,52.64 JP4.22
EW69  (via drill 0.38)
  Top 0.152: 16.86,53.44 v16.89,53.4 16.92,53.44 U6.20
  Bottom 0.152: JP4.19 9.14,49.28 11.3,49.28 15.43,53.4 v16.89,53.4
EW70
  Top 0.152: JP4.20 11.43,51.56 11.81,51.94 14.1,54.24 U6.19
EW71  (via drill 0.38)
  Top 0.152: U6.18 16.94,55.04 v16.89,54.99
  Bottom 0.152: JP4.17 9.14,51.82 11.3,51.82 14.48,54.99 v16.89,54.99
EW72
  Top 0.152: JP4.18 11.37,54.04 11.56,54.23 13.16,55.84 U6.17
EW73  (via drill 0.38)
  Top 0.152: 17.15,56.64 v16.89,56.64 v16.9,56.64 U6.16
  Bottom 0.152: JP4.15 9.14,54.36 11.3,54.36 13.59,56.64 v16.89,56.64
EW74
  Top 0.152: JP4.16 12.22,57.44 U6.15
EW75  (via drill 0.38)
  Top 0.152: 16.96,58.24 v16.89,58.23 v16.9,58.24 U6.14
  Bottom 0.152: v16.89,58.23 12.7,58.23 11.37,56.9 9.14,56.9 JP4.13
EW76
  Top 0.152: JP4.14 11.28,59.04 U6.13
EW77  (via drill 0.38)
  Top 0.152: 16.62,59.84 v16.89,59.88 16.94,59.84 U6.12
  Bottom 0.152: v16.89,59.88 11.75,59.88 11.3,59.44 9.14,59.44 JP4.11
EW78
  Top 0.152: U6.11 10.48,60.64 JP4.12
EW79  (via drill 0.38)
  Top 0.152: 16.86,61.44 v16.89,61.4 16.92,61.44 U6.10
  Bottom 0.152: v16.89,61.4 11.87,61.4 11.3,61.98 9.14,61.98 JP4.9
EW80
  Top 0.152: JP4.10 11.42,62.24 U6.9
EW81  (via drill 0.38)
  Top 0.152: U6.8 16.94,63.04 v16.89,62.99
  Bottom 0.152: v16.89,62.99 12.83,62.99 11.3,64.52 9.14,64.52 JP4.7
EW82
  Top 0.152: JP4.8 12.36,63.84 U6.7
EW83  (via drill 0.38)
  Top 0.152: 16.84,64.64 v16.89,64.64 v16.9,64.64 U6.6
  Bottom 0.152: JP4.5 9.14,67.06 11.3,67.06 13.72,64.64 v16.89,64.64
EW84
  Top 0.152: U6.5 13.3,65.44 JP4.6
EW85  (via drill 0.38)
  Top 0.152: U6.4 v16.9,66.24 v16.89,66.23
  Bottom 0.152: JP4.3 9.14,69.6 11.3,69.6 12.13,68.77 12.32,68.58 14.67,66.23 v16.89,66.23
EW86
  Top 0.152: U6.3 14.24,67.04 JP4.4
EW87  (via drill 0.38)
  Top 0.152: 17,67.84 v16.89,67.88 16.94,67.84 U6.2
  Bottom 0.152: JP4.1 9.14,72.14 11.3,72.14 15.56,67.88 v16.89,67.88
EW88
  Top 0.152: U6.1 18.17,68.7 15.12,68.7 JP4.2
EW89  (via drill 0.38)
  Top 0.152: U6.80 20.67,72.04 v20.64,72.14
  Bottom 0.152: v20.64,72.14 20.64,72.71 19.94,73.41 18.16,73.41 16.38,75.18 16.38,77.09 JP5.15
EW90
  Top 0.152: U6.79 21.47,73.14 20.19,74.42 19.3,74.42 JP5.16
EW91  (via drill 0.38)
  Top 0.152: U6.78 22.27,72.09 v22.23,72.14
  Bottom 0.152: v22.23,72.14 22.23,72.9 20.7,74.42 19.56,74.42 19.05,74.93 19.05,77.22 JP5.13
EW92
  Top 0.152: U6.77 23.07,73.83 22.23,74.68 21.59,74.68 JP5.14
EW93  (via drill 0.38)
  Top 0.152: U6.76 23.87,72.07 v23.88,72.14
  Bottom 0.152: v23.88,72.14 23.88,73.79 23.24,74.42 22.35,74.42 21.59,75.18 21.59,77.22 JP5.11
EW94
  Top 0.152: U6.75 24.67,74.14 JP5.12
EW95  (via drill 0.38)
  Top 0.152: U6.74 25.47,72.07 v25.46,72.14
  Bottom 0.152: v25.46,72.14 25.46,73.85 24.13,75.18 24.13,77.22 JP5.9
EW96
  Top 0.152: U6.73 26.27,75.08 JP5.10
EW97  (via drill 0.38)
  Top 0.152: U6.72 27.07,72.12 v27.05,72.14
  Bottom 0.152: v27.05,72.14 27.05,74.68 26.67,75.06 26.67,77.22 JP5.7
EW98
  Top 0.152: U6.71 27.87,75.88 JP5.8
EW99  (via drill 0.38)
  Top 0.152: U6.70 28.67,72.04 v28.64,72.07
  Bottom 0.152: v28.64,72.07 28.64,74.8 29.15,75.31 29.15,77.15 JP5.5
EW100
  Top 0.152: U6.69 29.47,74.94 JP5.6
EW101  (via drill 0.38)
  Top 0.152: U6.68 30.27,72.05 v30.29,72.14
  Bottom 0.152: v30.29,72.14 30.29,73.85 31.75,75.31 31.75,77.22 JP5.3
EW102
  Top 0.152: U6.67 31.07,74 JP5.4
EW103  (via drill 0.38)
  Top 0.152: U6.66 31.87,72.07 v31.88,72.14
  Bottom 0.152: v31.88,72.14 31.88,72.39 34.29,74.8 34.29,77.22 JP5.1
EW104
  Top 0.152: U6.65 32.67,73.06 JP5.2
EW105  (via drill 0.38)
  Top 0.152: U6.64 36.01,68.64 v36.45,69.09
  Bottom 0.152: JP6.23 44.2,74.68 42.04,74.68 v36.45,69.09
EW106
  Top 0.152: U6.63 37.36,67.84 JP6.24
EW107  (via drill 0.38)
  Top 0.152: U6.62 36.43,67.04 v36.45,67.06
  Bottom 0.152: JP6.21 44.2,72.14 42.04,72.14 36.96,67.06 v36.45,67.06
EW108
  Top 0.152: U6.61 38.3,66.24 JP6.22
EW109  (via drill 0.38)
  Top 0.152: U6.60 36.48,65.44 v36.45,65.47
  Bottom 0.152: JP6.19 44.2,69.6 42.04,69.6 37.91,65.47 v36.45,65.47
EW110
  Top 0.152: U6.59 39.24,64.64 JP6.20
EW111  (via drill 0.38)
  Top 0.152: U6.58 36.4,63.84 v36.45,63.88
  Bottom 0.152: JP6.17 44.2,67.06 42.04,67.06 38.86,63.88 v36.45,63.88
EW112
  Top 0.152: U6.57 40.18,63.04 JP6.18
EW113  (via drill 0.38)
  Top 0.152: U6.56 36.19,62.24 v36.45,62.23
  Bottom 0.152: JP6.15 44.2,64.52 42.04,64.52 39.75,62.23 v36.45,62.23
EW114
  Top 0.152: JP6.16 42.16,62.48 41.78,62.1 41.12,61.44 U6.55
EW115  (via drill 0.38)
  Top 0.152: U6.54 36.38,60.64 v36.45,60.64
  Bottom 0.152: JP6.13 44.2,61.98 42.04,61.98 40.7,60.64 v36.45,60.64
EW116
  Top 0.152: U6.53 42.06,59.84 JP6.14
EW117  (via drill 0.38)
  Top 0.152: U6.52 36.72,59.04 v36.45,58.99
  Bottom 0.152: v36.45,58.99 41.59,58.99 42.04,59.44 44.2,59.44 JP6.11
EW118
  Top 0.152: U6.51 42.86,58.24 JP6.12
EW119  (via drill 0.38)
  Top 0.152: U6.50 36.48,57.44 v36.45,57.47
  Bottom 0.152: v36.45,57.47 41.47,57.47 42.04,56.9 44.2,56.9 JP6.9
EW120
  Top 0.152: U6.49 41.92,56.64 JP6.10
EW121  (via drill 0.38)
  Top 0.152: U6.48 36.41,55.84 v36.45,55.88
  Bottom 0.152: v36.45,55.88 40.51,55.88 42.04,54.36 44.2,54.36 JP6.7
EW122
  Top 0.152: U6.47 40.98,55.04 JP6.8
EW123  (via drill 0.38)
  Top 0.152: U6.46 v36.46,54.24 | 36.51,54.24 v36.46,54.24 | v36.46,54.24 v36.45,54.23
  Bottom 0.152: JP6.5 44.2,51.82 42.04,51.82 39.62,54.24 v36.46,54.24 v36.45,54.23
EW124
  Top 0.152: U6.45 40.04,53.44 JP6.6
EW125  (via drill 0.38)
  Top 0.152: U6.44 v36.44,52.64 v36.45,52.64
  Bottom 0.152: JP6.3 44.2,49.28 42.04,49.28 38.67,52.64 v36.45,52.64
EW126
  Top 0.152: U6.43 39.1,51.84 JP6.4
EW127  (via drill 0.38)
  Top 0.152: U6.42 36.34,51.04 v36.45,50.99
  Bottom 0.152: JP6.1 44.2,46.74 42.04,46.74 37.78,50.99 v36.45,50.99
EW128
  Top 0.152: 35.17,50.17 38.22,50.17 JP6.2
  Top 0.254: 35.17,50.17 U6.41
GND  (via drill 0.38, 0.64)
  Top 0.254: 27.07,45.32 27.45,45.83 | LED1.C 53.58,69.86 58.42,65.02 73.91,65.02 v74.29,64.64
  Top 0.508: U1.6 72.14,33.78 72.9,34.54 | 72.9,34.54 77.49,34.54 | LED2.C 70.6,17.51 70.36,17.27 66.29,17.27 64.77,18.8 TP7.TP | U1.4 64.52,32.51 63.75,31.75 63.75,30.99 64.26,30.48 71.12,30.48 | 71.12,30.48 77.72,30.48 77.98,30.48 | R1.1 77.49,32.49 77.72,32.26 | 53.59,70.09 LED1.C | v62.61,50.04 R3.1 | 27.07,45.72 27.07,45.32 C10.2 27.87,45.65 U6.34 | 27.07,45.72 26.27,46.52 U6.32 | 25.66,36.83 C9.2 | C9.2 27.07,36.43 U5.32 | U1.7 72.39,35.05 72.9,34.54 | 80.01,28.45 80.01,26.95 C1.2 | C2.2 70.1,27.94 71.12,28.96 71.12,30.48 | U5.33 26.27,37.23 C9.2 | U5.34 25.47,36.9 | 25.47,36.9 C9.2 | U6.33 27.07,45.72 | 27.45,45.83 29.1,45.83 v29.21,45.72 | v37.08,43.05 36.57,43.05 C7.2 | C5.2 v19.49,42.8 | C8.2 v19.49,39.75 19.3,39.75 | v24.45,37.28 v24.45,37.27 24.83,36.9 25.47,36.9 | C6.2 37.21,39.25 v37.34,39.37
  Top 1.27: R1.1 77.49,34.54 77.49,32.53 C3.2 | C1.2 79.91,19.97 v79.25,19.3 | v79.5,33.27 78.49,32.26 77.72,32.26 77.72,30.48 | C4.- TP6.TP | U2.P$12 67.69,71.25 v74.29,64.64 | 77.98,30.48 80.01,28.45
  Bottom 0.508: 65.02,17.78 64.77,18.29 | v19.49,42.8 19.69,42.93 19.69,43.81 21.59,45.72 v29.21,45.72 34.54,45.72 37.21,43.05 | v19.49,39.75 20.19,39.75 22.67,37.27 v24.45,37.27 24.51,37.34 31.24,37.34 33.27,39.37 v37.34,39.37 45.47,39.37 52.58,32.26 53.09,32.26 | v37.08,43.05 37.21,43.05 | 37.21,43.05 37.34,42.93 51.31,42.93 53.09,41.16 TP5.TP
  Bottom 1.27: v79.25,19.3 77.72,17.78 65.02,17.78 | v79.5,33.27 79.5,39.62 | 79.5,39.62 TP6.TP | v62.61,50.04 64.26,50.04 65.28,49.02 65.28,40.64 66.29,39.62 79.5,39.62 | U2.P$21 72.77,63.12 v74.29,64.64 75.69,66.04 98.04,66.04 102.87,61.47 102.87,58.17 101.6,56.9 85.34,56.9 83.57,55.12 83.57,19.05 75.95,11.43 75.95,5.98 X1.2 | TP4.TP 55.37,6.1 53.09,8.38 53.09,32.26 TP5.TP
  Bottom 2.54: X1.2 X1.3 66.8,4.19 64.77,6.22 | 64.77,6.22 64.77,18.29 TP7.TP | TP4.TP 64.64,6.1 64.77,6.22
LE_L  (via drill 0.38)
  Top 0.254: U6.38 31.07,43.52 30.78,43.18 v29.46,43.18 | v51.31,35.31 60.45,26.16 v60.58,26.16 | U5.38 22.27,39.1 v22.29,39.12
  Bottom 0.254: U2.P$7 81.66,55.63 81.66,28.32 79.5,26.16 v60.58,26.16 | v51.31,35.31 46.48,40.13 32.7,40.13 30.86,38.29 23.11,38.29 v22.29,39.12 22.1,39.31 22.1,40.89 24.38,43.18 v29.46,43.18
N$1
  Top 0.254: U1.5 C3.1
N$2
  Top 0.254: Q1.1 88.65,34.04 82.3,40.39 63.25,40.39 62.61,39.75 62.61,37.21 63.5,36.32 U1.1
N$3
  Top 0.406: 74.42,37.34 74.42,36.8 R1.2
  Top 0.813: U1.8 74.4,36.32 R1.2 | Q1.3 87.5,23.75
  Top 1.27: 87.5,23.75 84.84,26.42 84.84,35.31 81.03,39.12 76.2,39.12 74.42,37.34
N$4
  Top 0.813: 101.98,21.97 102.11,22.1 102.11,25.02 Q1.2 103.12,29.34 103.12,30.61 103.39,30.87 | D1.A 103.63,35.05 103.89,35.31
  Top 2.54: L1.2 101.98,21.97 | 103.39,30.87 D1.A
N$5
  Top 0.254: R4.1 R4.2 66.87,45.91 63.83,45.91 R3.2
N$6
  Top 0.254: U1.3 62.23,33.78 61.34,34.67 61.34,41.66 | R4.3 61.98,44.2 61.34,43.56 61.34,41.66 | R2.1 88.9,35.05 82.3,41.66 61.34,41.66
N$10
  Top 0.254: R5.1 51.88,70.3 LED1.A
N$11
  Top 0.254: R6.1 68.9,18.74 LED2.A
N$12
  Top 0.254: U2.P$4 93.09,60.83 93.98,61.72 101.09,61.72 102.62,60.2 102.62,56.39 TP8.TP
N$13
  Top 0.254: 21.46,34.54 21.46,34.62 U5.39 21.47,36.84 TP9.TP
N$14
  Top 0.254: U6.39 31.87,45.71 TP10.TP
POL_L  (via drill 0.38)
  Top 0.254: v77.85,53.72 62.08,53.72 v50.24,41.89 | U6.30 24.67,41.62 v24.89,41.4 | v28.7,40.64 28.7,34.65 U5.30
  Bottom 0.254: v77.85,53.72 78.49,53.72 82.93,58.17 U2.P$8 | v50.24,41.89 49,40.64 v28.7,40.64 25.65,40.64 v24.89,41.4
PP5V0  (via drill 0.38)
  Top 0.254: TP2.TP 53.09,75.69 53.85,74.93 53.85,72.96 R5.2 54.1,72.58 54.1,72.39 v57.4,69.09 | v55.88,50.93 55.88,49.02 v48.77,41.91 | v29.97,41.66 29.21,42.42 27.43,42.42 C10.1 26.79,42.54 26.16,41.91 26.16,40.13 C9.1
  Top 0.508: C10.1 25.47,44.12 U6.31 | C9.1 27.87,38.43 U5.31
  Bottom 0.254: v55.88,50.93 55.88,67.56 v57.4,69.09 58.55,70.23 70.23,70.23 72.77,72.77 U2.P$23 | v48.77,41.91 48.01,41.15 30.48,41.15 v29.97,41.66
PP12V0  (via drill 0.38, 0.64)
  Top 0.254: TP3.TP 70.87,21.15 R6.2 71.3,21.58 75.07,21.58 74.81,22.35
  Top 0.813: C2.1 64.52,27.94 62.48,29.97 v62.48,32 | v63.63,35.05 U1.2 | 59.94,68.83 v59.94,68.82
  Top 1.27: U2.P$20 65.15,74.04 59.94,68.83 | C2.1 64.77,27.69 66.55,25.91 74.13,25.91 C1.1 74.81,22.35 74.81,14.67 X1.1 72.08,11.94 67.82,11.94 62.48,17.27 62.48,27.18 v61.21,28.45
  Top 2.54: X1.1 85.29,11.99 L1.1
  Bottom 0.813: v62.48,32 62.48,33.91 v63.63,35.05 | v59.94,68.82 59.93,68.82
  Bottom 1.27: 59.93,68.82 57.66,66.55 57.66,58.67 60.07,56.26 60.07,29.59 v61.21,28.45
PP_VAR_VHI  (via drill 0.38)
  Top 0.254: R2.2 D1.C 98.17,35.17 | 100.84,47.5 C4.+ 101.09,47.9
  Top 0.508: 101.09,47.9 101.09,52.83 97.66,56.26 v57.79,56.26 v51.82,56.26 | U6.40 34.76,45.85 C7.1 35.31,46.23 v35.31,47.75 | U6.25 18.33,45.6 C5.1 17.9,45.72 v19.56,45.72 | U5.40 18.33,36.95 C8.1 v17.78,35.31 | C6.1 35.44,36.32 v33.53,36.32 | C6.1 36.45,36.95 39.12,39.62 52.07,39.62 v57.79,45.34 | C6.1 35.56,35.56 34.54,34.54 32.74,34.54 U5.25
  Top 1.27: TP1.TP C4.+
  Top 2.54: 100.84,47.5 98.17,44.83 98.17,35.17
  Bottom 0.508: v19.56,45.72 20.07,45.72 21.08,46.74 32.77,46.74 33.78,47.75 v35.31,47.75 35.56,47.75 39.37,43.94 47.75,43.94 49.53,45.72 49.53,53.98 v51.82,56.26 | v33.53,36.32 20.07,36.32 19.05,35.31 v17.78,35.31 | v57.79,45.34 v57.79,56.26

### Text on the board
tPlace: 89 | 12V | GND | 5V | 105 | GND | 65 | 1 | 41 | 25 | 12V | Driver Board
bPlace: Stanford Unversity | Ben Wang | Mimi Yang | 3/30/2106